# EAGLE design sa-22c-microsemi-connector-flip (EAGLE 9.5.2)
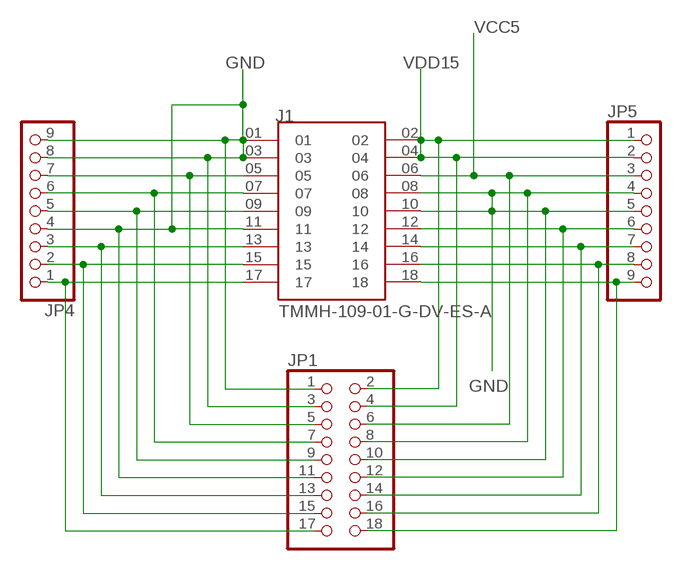
[diagram p0: schematic, sheet 1]

## Parts
J1  TMMH-109-01-G-DV-ES-A  [SAMTEC_TMMH-109-01-G-DV-ES-A]
JP1  PINHD-2X9  [2X09]
JP4  PINHD-1X9  [1X09]
JP5  PINHD-1X9  [1X09]

## Nets
GND: J1.01 J1.03 J1.08 J1.10 J1.11 JP1.1 JP1.3 JP1.8 JP1.10 JP1.11 JP4.4 JP4.8 JP4.9 JP5.4 JP5.5
N$3: J1.05 JP1.5 JP4.7
N$4: J1.07 JP1.7 JP4.6
N$5: J1.09 JP1.9 JP4.5
N$7: J1.13 JP1.13 JP4.3
N$8: J1.15 JP1.15 JP4.2
N$9: J1.17 JP1.17 JP4.1
N$15: J1.12 JP1.12 JP5.6
N$16: J1.14 JP1.14 JP5.7
N$17: J1.16 JP1.16 JP5.8
N$18: J1.18 JP1.18 JP5.9
VCC5: J1.06 JP1.6 JP5.3
VDD15: J1.02 J1.04 JP1.2 JP1.4 JP5.1 JP5.2

## Library data of the parts
J1 = TMMH-109-01-G-DV-ES-A:TMMH-109-01-G-DV-ES-A; MANUFACTURER: Samtec; PARTREV: R; STANDARD: Manufacturer Recommendations
JP1 = pinhead:PINHD-2X9: PIN HEADER
JP4 JP5 = pinhead:PINHD-1X9: PIN HEADER

## Board
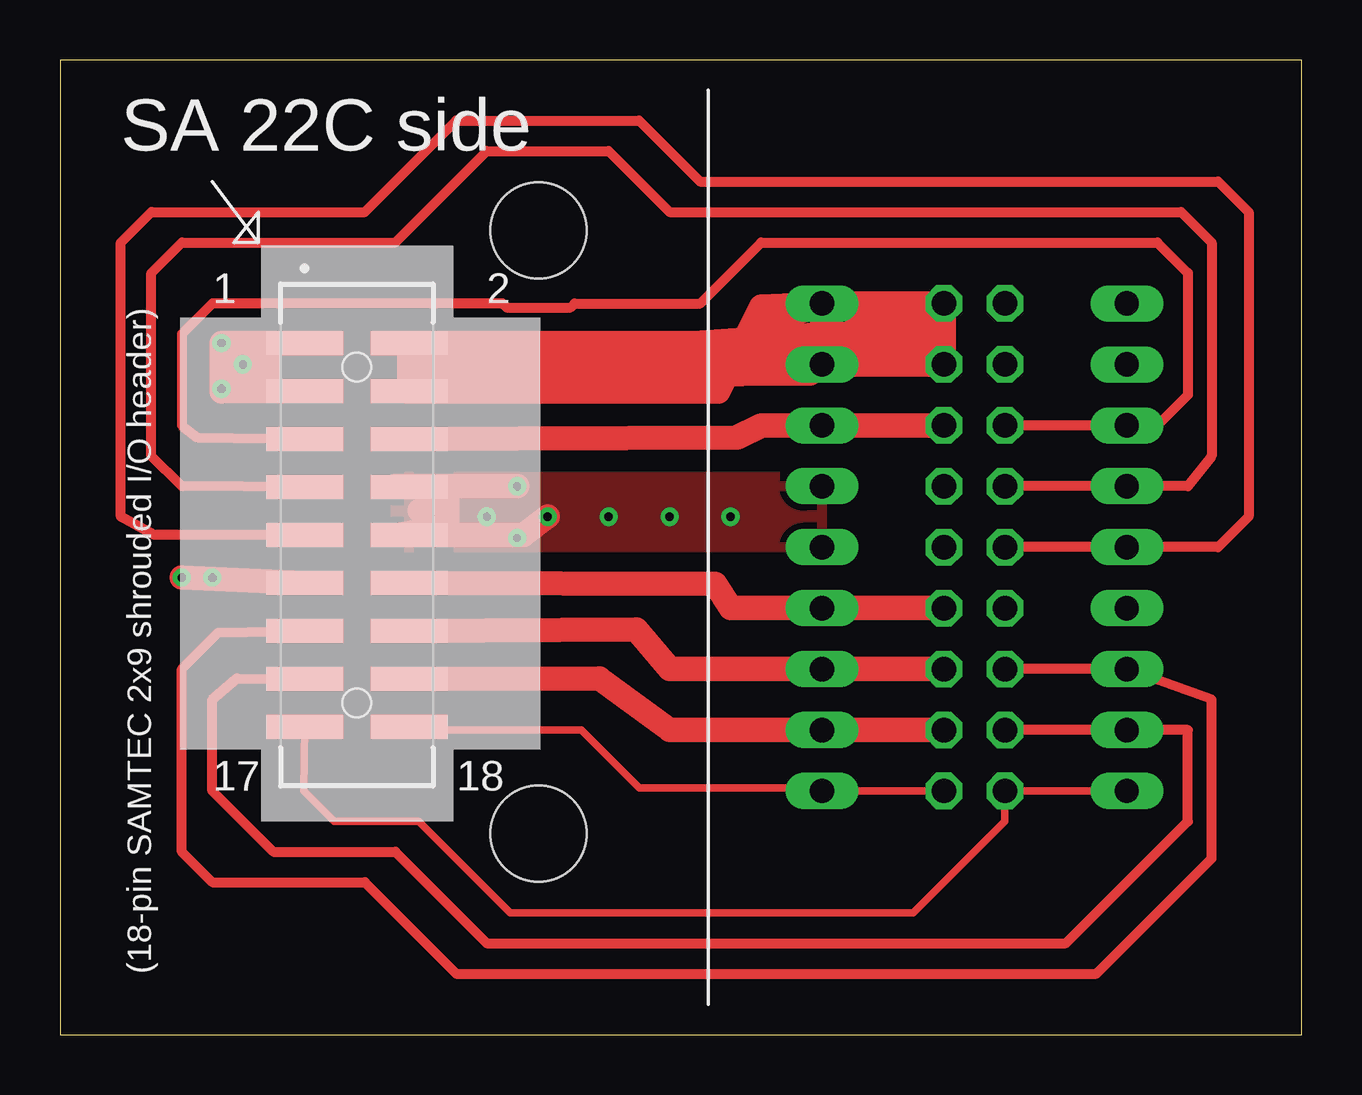
[diagram p1: board, top side]
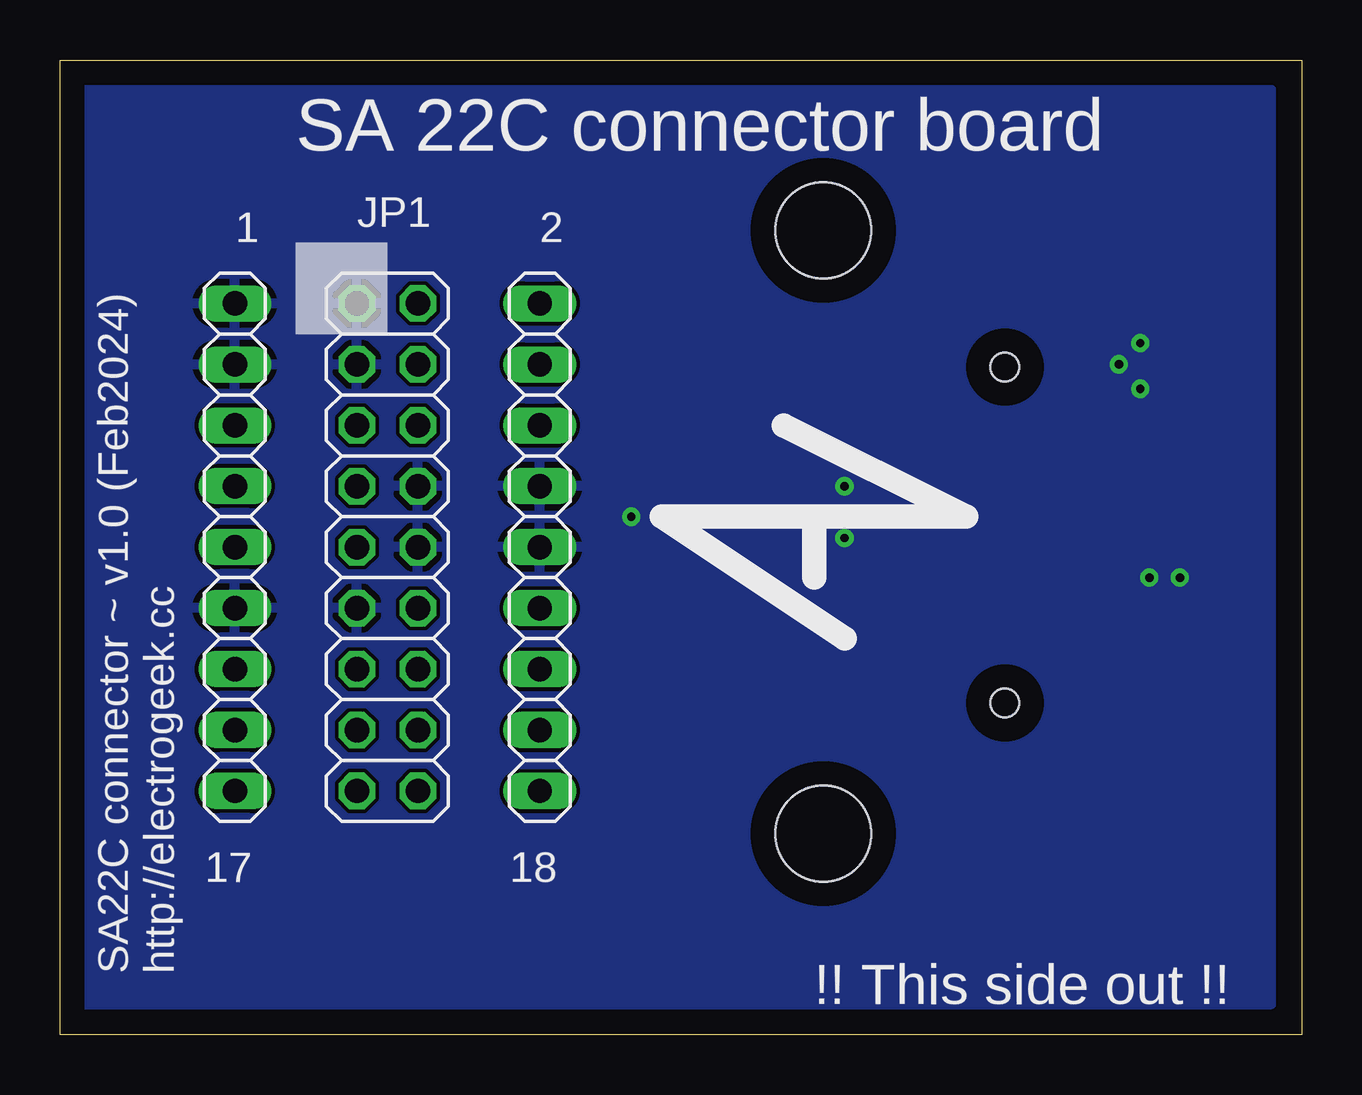
[diagram p2: board, bottom side, seen from below]

Size 51.74 x 40.63 mm. Coordinates in mm from the lower left corner, seen from the top.
Outline: 0,0 51.74,0 51.74,40.63 0,40.63 0,0
Copper layers (1*16): Top 0.035mm / dielectric 1.5mm / Bottom 0.035mm
Design rules "default": minimum track width 6mil, minimum drill 0.35mm, track to track 6mil, track to pad 6mil, pad to pad 6mil, via to via 6mil, smd to smd 6mil, copper to edge 40mil, drill to drill 6mil, minimum pad ring 10mil, minimum via ring 8mil, stop-mask expansion 4mil, vias tented up to drill 0mil, thermal gap 10mil
Holes 4 mm at 19.94,8.38 19.94,33.53

### Footprints (pad centres in the part's own frame; a part is rotated, then mirrored left to right if it is on the bottom)
SAMTEC_TMMH-109-01-G-DV-ES-A = smd 1.016 x 3.21: 01 0,0; 02 0,4.354; 03 2,0; 04 2,4.354; 05 4,0; 06 4,4.354; 07 6,0; 08 6,4.354; 09 8,0; 10 8,4.354; 11 10,0; 12 10,4.354; 13 12,0; 14 12,4.354; 15 14,0; 16 14,4.354; 17 16,0; 18 16,4.354 | hole 1.19: 1,2.177; 15,2.177
2X09 = drill 1.016 octagon: 1 -10.16,-1.27; 2 -10.16,1.27; 3 -7.62,-1.27; 4 -7.62,1.27; 5 -5.08,-1.27; 6 -5.08,1.27; 7 -2.54,-1.27; 8 -2.54,1.27; 9 0,-1.27; 10 0,1.27; 11 2.54,-1.27; 12 2.54,1.27; 13 5.08,-1.27; 14 5.08,1.27; 15 7.62,-1.27; 16 7.62,1.27; 17 10.16,-1.27; 18 10.16,1.27
1X09 = drill 1.016 long: 1 -10.16,0; 2 -7.62,0; 3 -5.08,0; 4 -2.54,0; 5 0,0; 6 2.54,0; 7 5.08,0; 8 7.62,0; 9 10.16,0

### Placement (x,y rotation side)
J1  10.19,28.83 270 top
JP1  38.1,20.32 270 bottom
JP4  44.45,20.32 90 bottom
JP5  31.75,20.32 270 bottom

### Tracks (layer width: path | path; a pad name or v marks a point on that pad's centre or on a via)
GND  (via drill 0.35)
  Top 1.016: J1.01 v6.73,28.83 | v6.73,28.83 v6.73,26.92 6.73,26.8 J1.03 | J1.11 v5.08,19.05 | v19.05,22.86 13.97,22.86 | v20.32,21.59 19.3,20.83 14.1,20.83 16.13,21.21 16.13,22.61 14.99,21.84 | v6.73,28.83 v7.62,27.94 8.64,26.92 8.64,28.7 6.86,26.92
  other vias: 17.78,21.59 19.05,20.7 22.86,21.59 25.4,21.59 27.94,21.59 6.35,19.05
  pour Bottom: 1.27,39.37 50.8,39.37 50.8,1.27 1.27,1.27
  pour Top: 31.75,23.24 13.97,23.24 13.97,20.32 31.75,20.32
N$3
  Top 0.406: JP1.5 JP4.7 45.72,25.4 46.99,26.67 46.99,31.75 45.72,33.02 29.21,33.02 26.67,30.48 21.44,30.48 21.27,30.31 18.61,30.31 18.43,30.48 6.35,30.48 5.08,29.21 5.08,25.4 5.71,24.89 J1.05
N$4
  Top 0.406: J1.07 5.08,22.86 3.81,24.13 3.81,31.75 5.08,33.02 13.97,33.02 17.78,36.83 22.86,36.83 25.4,34.29 46.71,34.29 47.98,33.02 47.98,24.13 46.99,22.86 JP4.6 JP1.7
N$5
  Top 0.406: J1.09 3.94,20.83 2.54,21.59 2.54,33.02 3.81,34.29 12.7,34.29 16.51,38.1 24.13,38.1 26.67,35.56 48.26,35.56 49.53,34.29 49.53,21.59 48.26,20.32 JP4.5 JP1.9
N$7
  Top 0.406: JP1.13 JP4.3 47.98,13.97 47.98,7.34 43.18,2.54 16.51,2.54 12.7,6.35 6.35,6.35 5.08,7.62 5.08,15.24 6.6,16.76 J1.13
N$8
  Top 0.406: JP1.15 JP4.2 46.99,12.7 46.99,8.89 41.91,3.81 17.78,3.81 13.97,7.62 8.89,7.62 6.35,10.16 6.35,13.97 7.37,14.86 J1.15
N$9
  Top 0.305: JP4.1 JP1.17 39.37,8.89 35.56,5.08 18.76,5.08 14.95,8.89 11.43,8.89 10.16,10.16 J1.17
N$15
  Top 1.016: J1.12 27.3,18.8 27.94,17.78 JP5.6 JP1.12
N$16
  Top 1.016: J1.14 24,16.89 25.4,15.24 JP5.7 JP1.14
N$17
  Top 1.016: J1.16 22.48,14.86 25.4,12.7 JP5.8 JP1.16
N$18
  Top 0.305: J1.18 14.67,12.7 21.71,12.7 24.13,10.29 31.62,10.29 JP5.9 JP1.18
VCC5
  Top 1.016: J1.06 28.19,24.89 29.21,25.4 JP5.3 JP1.6
VDD15
  Top 1.016: J1.04 J1.02 26.42,28.83 | 26.42,28.83 26.54,28.83 27.94,27.94 JP5.2 | JP5.2 31.75,29.21 | 31.75,29.21 JP5.1 | 31.88,30.48 36.2,30.48 | 36.2,30.48 JP1.2 36.83,29.21 | 36.83,29.21 JP1.4 | 14.48,26.8 27.43,26.8 29.21,30.35 31.88,30.48 | JP5.2 15.24,27.94 | JP5.2 31.24,27.56 14.73,27.43 | 31.75,29.21 26.42,28.83 | JP5.1 29.46,29.59 | JP5.2 JP1.4 | JP1.4 31.75,29.21 | 31.75,29.21 36.83,29.21 | 36.83,29.21 JP5.1 | JP5.1 31.88,30.48 | 36.2,30.48 36.2,28.07 | JP5.2 28.96,28.7

### Text on the board
tPlace: SA 22C side | 1 | 2 | 17 | 18 | (18-pin SAMTEC 2x9 shrouded I/O header)
bPlace: SA 22C connector board | 2 | 1 | 18 | 17 | SA22C connector ~ v1.0 (Feb2024) / http://electrogeek.cc | !! This side out !!